# Altium schematic sheet [3]_I2C_TO_UART.SchDoc
size B
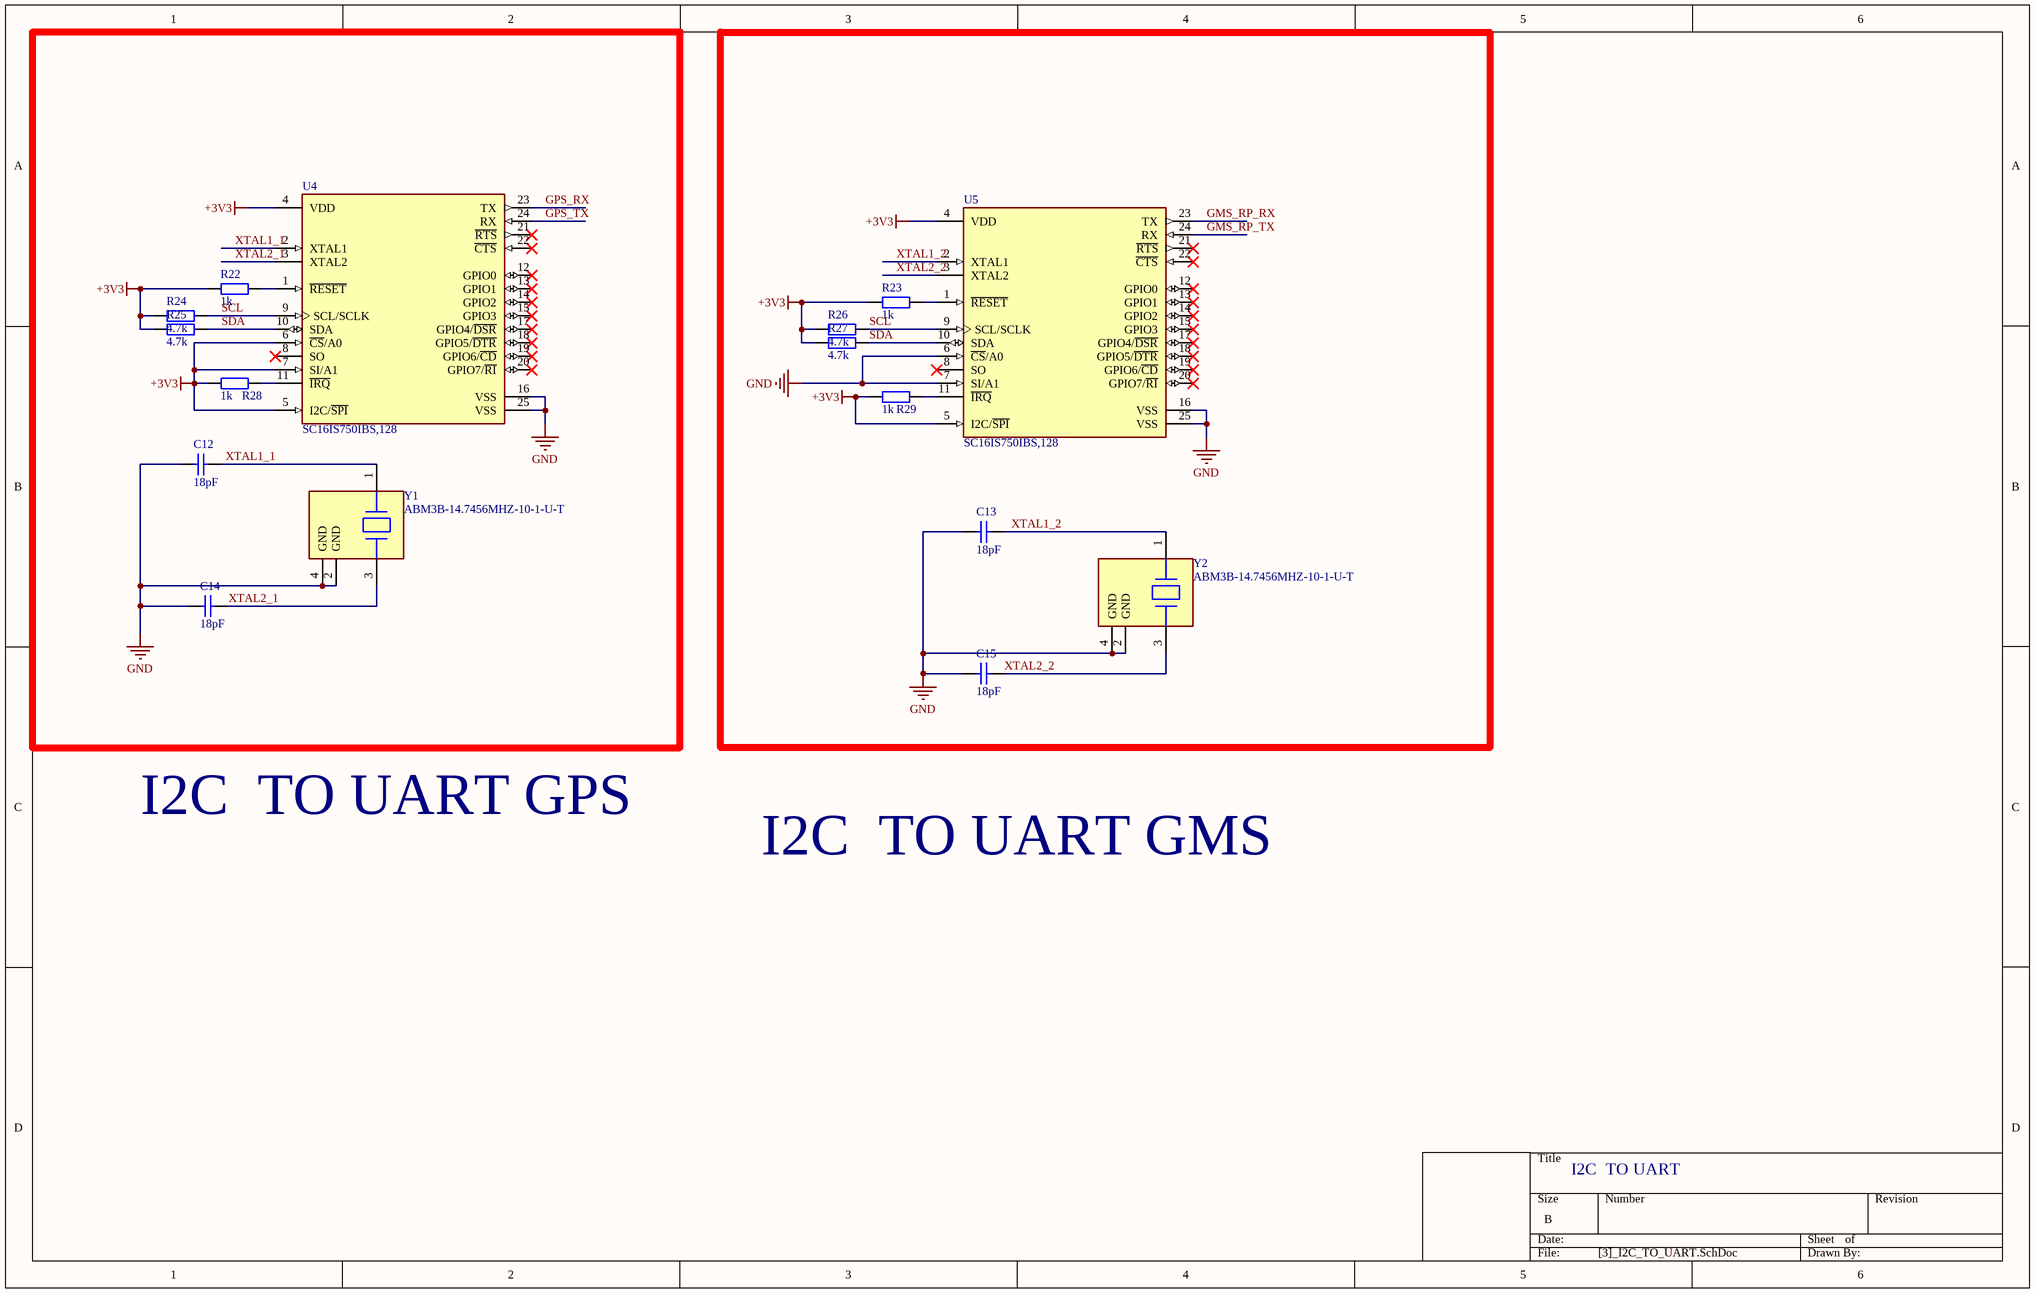
[diagram p0: [3]_I2C_TO_UART.SchDoc]

## Parts
C12  18pF  [tu 0603]
C13  18pF  [tu 0603]
C14  18pF  [tu 0603]
C15  18pF  [tu 0603]
R22  1k  [tro smd 0603]
R23  1k  [tro smd 0603]
R24  4.7k  [tro smd 0603]
R25  4.7k  [tro smd 0603]
R26  4.7k  [tro smd 0603]
R27  4.7k  [tro smd 0603]
R28  1k  [tro smd 0603]
R29  1k  [tro smd 0603]
U4  SC16IS750IBS,128  [FP-SOT616-3-MFG]
U5  SC16IS750IBS,128  [FP-SOT616-3-MFG]
Y1  ABM3B-14.7456MHZ-10-1-U-T  [FP-ABM3B-MFG]
Y2  ABM3B-14.7456MHZ-10-1-U-T  [FP-ABM3B-MFG]

## Nets
+3V3: R22.1 R23.1 R24.1 R25.1 R26.1 R27.1 R28.1 R29.1 U4.4(VDD) U4.5(I2C/~{SPI}) U4.6(~{CS}/A0) U4.7(SI/A1) U5.4(VDD) U5.5(I2C/~{SPI})
GND: C12.2 C13.2 C14.2 C15.2 U4.16(VSS) U4.25(VSS) U5.6(~{CS}/A0) U5.7(SI/A1) U5.16(VSS) U5.25(VSS) Y1.2(GND) Y1.4(GND) Y2.2(GND) Y2.4(GND)
GMS_RP_RX: U5.23(TX)
GMS_RP_TX: U5.24(RX)
GPS_RX: U4.23(TX)
GPS_TX: U4.24(RX)
SCL: R24.2 R26.2 U4.9(SCL/SCLK) U5.9(SCL/SCLK)
SDA: R25.2 R27.2 U4.10(SDA) U5.10(SDA)
XTAL1_1: C12.1 U4.2(XTAL1) Y1.1
XTAL1_2: C13.1 U5.2(XTAL1) Y2.1
XTAL2_1: C14.1 U4.3(XTAL2) Y1.3
XTAL2_2: C15.1 U5.3(XTAL2) Y2.3
NetR22_2: R22.2 U4.1(~{RESET})
NetR23_2: R23.2 U5.1(~{RESET})
NetR28_2: R28.2 U4.11(~{IRQ})
NetR29_2: R29.2 U5.11(~{IRQ})

Not connected (* = marked no-connect by the designer): U4 8(SO)* 12(GPIO0)* 13(GPIO1)* 14(GPIO2)* 15(GPIO3)* 17(GPIO4/~{DSR})* 18(GPIO5/~{DTR})* 19(GPIO6/~{CD})* 20(GPIO7/~{RI})* 21(~{RTS})* 22(~{CTS})*; U5 8(SO)* 12(GPIO0)* 13(GPIO1)* 14(GPIO2)* 15(GPIO3)* 17(GPIO4/~{DSR})* 18(GPIO5/~{DTR})* 19(GPIO6/~{CD})* 20(GPIO7/~{RI})* 21(~{RTS})* 22(~{CTS})*

## Notes on the sheet
- I2C  TO UART GPS
- I2C  TO UART GMS
- I2C  TO UART

## Library data of the parts
C12-C15 = Tu 0603 22pF 50V 10%: Dán; Don_Vi: Con; So_Chan: 2; Ten_Linh_Kien: Tụ 0603 22pF 50V 10%; Ma_Hang: MH004570; Chung_Loai: Dán; Kieu_Chan: *
R22-R29 = Tro 0603 1% 1k: Dán; So_Chan: 2; Don_Vi: Con; Ten_Linh_Kien: Trở 0603 1% 1k; Ma_Hang: MH006334; Chung_Loai: Dán; Kieu_Chan: *
U4 U5 = CMP-1651-00009-2: IC UART I2C/SPI 24-HVQFN; Max Supply Voltage: 3.6V; Data Rate: 5Mbps; Max Supply Current: 6mA; Memory Size: 64B; Min Supply Voltage: 2.3V; Operating Supply Voltage: 3.3V; Number of Channels: 1; Min Operating Temperature: -40°C; Mount: Surface Mount; Lead Free: Lead Free; Nominal Supply Current: 6mA; Number of Pins: 24; Max Operating Temperature: 95°C; Packaging: Tape and Reel; Package Quantity: 1500; Radiation Hardening: No; Operating Supply Current: 6mA
Y1 Y2 = CMP-27762-009747-1: Crystal 14.7456MHz ±10ppm 10pF SMD-4 5mm x 3.2mm; ESR (Equivalent Series Resistance): 70R; Operating Frequency: 14.7456 MHz; Min Operating Temperature: -10°C; Width: 0.126inch; Frequency Tolerance: 10ppm; REACH SVHC: No SVHC; Max Operating Temperature: 60°C; Termination: SMD/SMT; Load Capacitance: 10pF; Series: ABM3B; Frequency Stability: 10ppm; Mount: Surface Mount; Depth: 3.2mm; Package Quantity: 1000; Series Resistance: 70R; Frequency: 14.7456MHz; Number of Pins: 4; Packaging: Tape and Reel; Resistor Type: Ceramic; Tolerance: 10ppm; Height: 0.043inch; Length: 5mm; Case/Package: CSMD; Lead Free: Lead Free